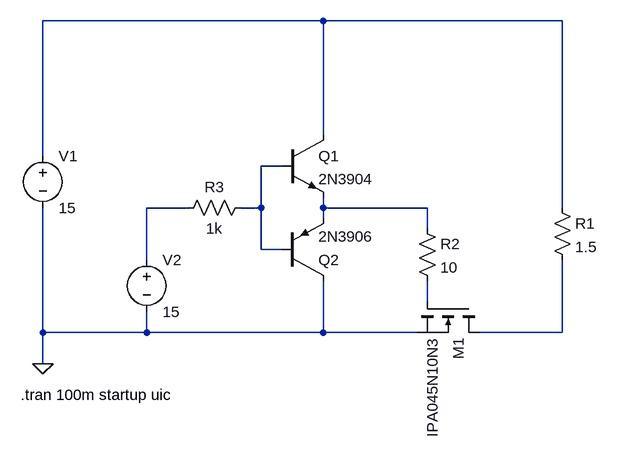
[diagram p0: schematic bjt-push-pull-mosfet.asc]
bjt-push-pull-mosfet.asc, the LTspice schematic file:
Version 4
SHEET 1 880 680
WIRE 176 -80 -256 -80
WIRE 544 -80 176 -80
WIRE 176 96 176 -80
WIRE -256 128 -256 -80
WIRE 112 144 80 144
WIRE -32 208 -96 208
WIRE 80 208 80 144
WIRE 80 208 48 208
WIRE 176 208 176 192
WIRE 336 208 176 208
WIRE 544 208 544 -80
WIRE 176 224 176 208
WIRE 336 240 336 208
WIRE 80 272 80 208
WIRE 112 272 80 272
WIRE -96 288 -96 208
WIRE 336 352 336 320
WIRE -256 400 -256 208
WIRE -96 400 -96 368
WIRE -96 400 -256 400
WIRE 176 400 176 320
WIRE 176 400 -96 400
WIRE 320 400 176 400
WIRE 544 400 544 288
WIRE 544 400 416 400
WIRE -256 448 -256 400
FLAG -256 448 0
SYMBOL npn 112 96 R0
SYMATTR InstName Q1
SYMATTR Value 2N3904
SYMBOL pnp 112 320 M180
SYMATTR InstName Q2
SYMATTR Value 2N3906
SYMBOL nmos 416 352 R90
SYMATTR InstName M1
SYMATTR Value IPA045N10N3
SYMBOL voltage -256 112 R0
WINDOW 123 0 0 Left 2
WINDOW 39 0 0 Left 2
SYMATTR InstName V1
SYMATTR Value 15
SYMBOL voltage -96 272 R0
WINDOW 123 0 0 Left 2
WINDOW 39 0 0 Left 2
SYMATTR InstName V2
SYMATTR Value 15
SYMBOL res 528 192 R0
SYMATTR InstName R1
SYMATTR Value 1.5
SYMBOL res 320 224 R0
SYMATTR InstName R2
SYMATTR Value 10
SYMBOL res 64 192 R90
WINDOW 0 0 56 VBottom 2
WINDOW 3 32 56 VTop 2
SYMATTR InstName R3
SYMATTR Value 1k
TEXT -290 496 Left 2 !.tran 100m startup uic

The netlist it stands for:
* bjt-push-pull-mosfet.asc
Q1 N001 N002 N004 0 2N3904
Q2 0 N002 N004 0 2N3906
M1 N006 N005 0 0 IPA045N10N3
V1 N001 0 15
V2 N003 0 15
R1 N001 N006 1.5
R2 N004 N005 10
R3 N002 N003 1k
.model NPN NPN
.model PNP PNP
.lib standard.bjt
.model NMOS NMOS
.model PMOS PMOS
.lib standard.mos
.tran 100m startup uic
.backanno
.end